# Altium schematic sheet 1_STM32F103C8-core.schdoc
size 497 x 243 mm; Name: A_A4; Symbol: A_A4; Device: A_A4; @Project Name: volume-adjuster-v1.0; REV: 1.0; Date: 2023-04-22; Sheet: 1/1; Draw By: wfei &amp; zzc; Company: 眼镜蛇小队; Convert to PCB: yes; Add into BOM: yes
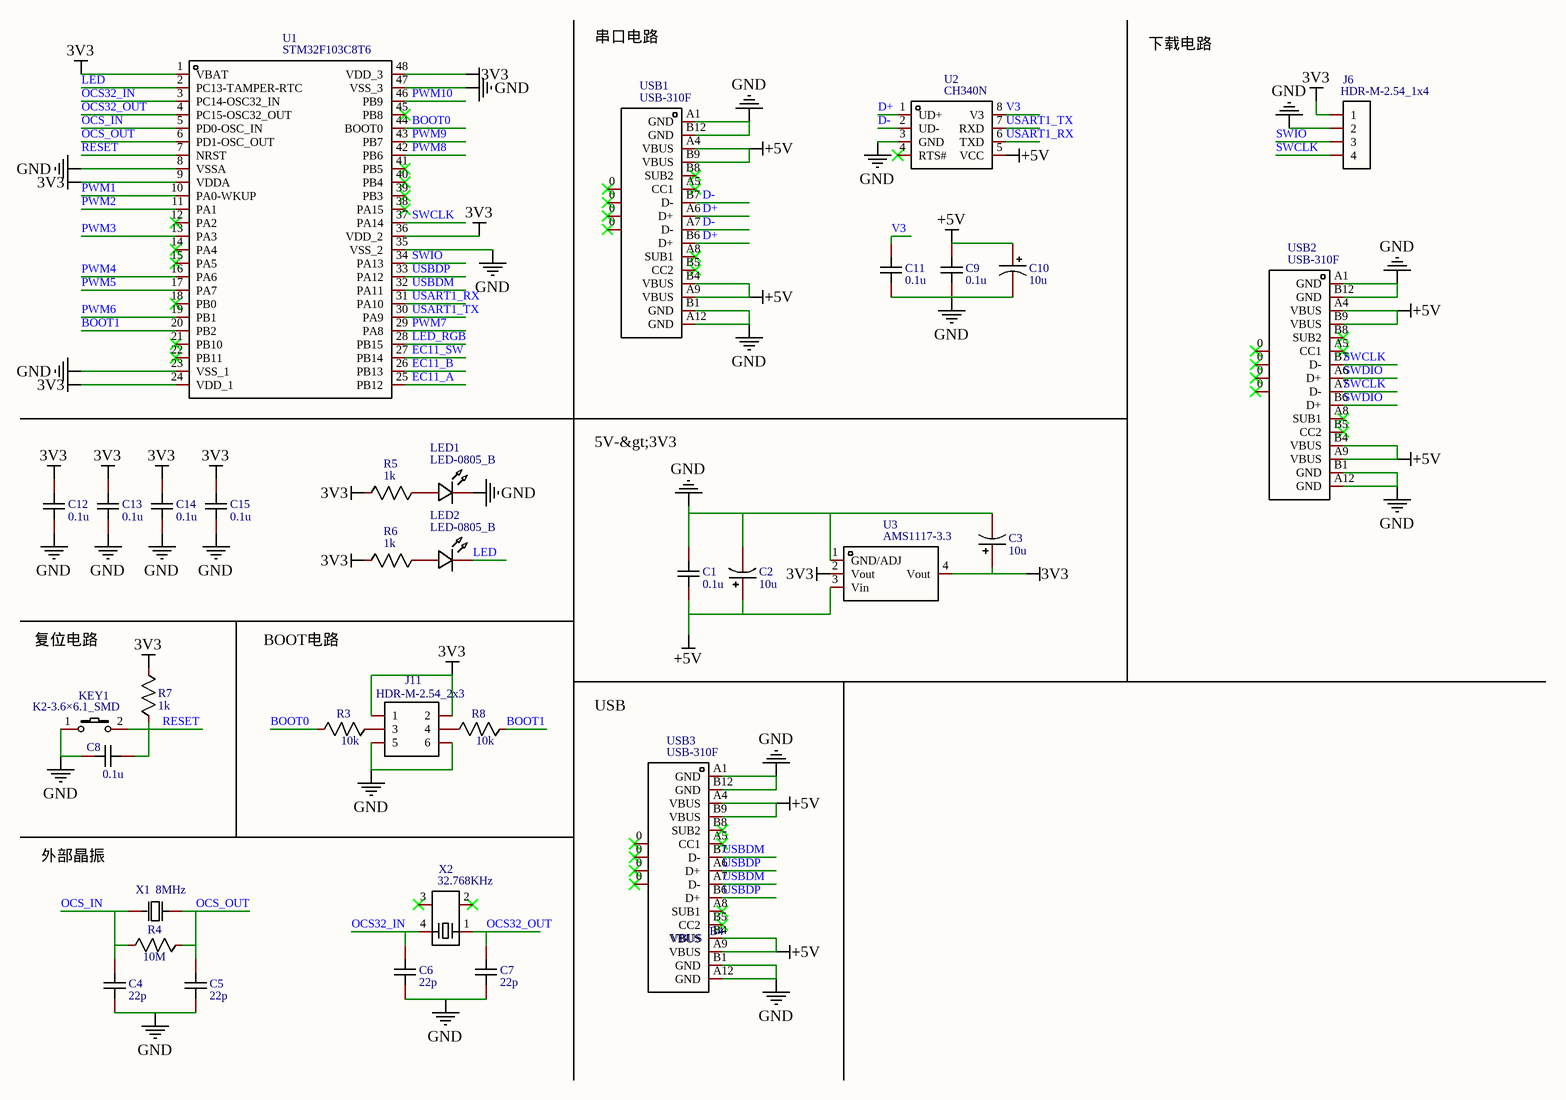
[diagram p0: 1_STM32F103C8-core.schdoc]

## Parts
C1  0.1u  [C0805]
C2  10u  [CASE-A_3216]
C3  10u  [CASE-A_3216]
C4  22p  [C0805]
C5  22p  [C0805]
C6  22p  [C0805]
C7  22p  [C0805]
C8  0.1u  [C0805]
C9  0.1u  [C0805]
C10  10u  [CASE-A_3216]
C11  0.1u  [C0805]
C12  0.1u  [C0805]
C13  0.1u  [C0805]
C14  0.1u  [C0805]
C15  0.1u  [C0805]
J6  HDR-M-2.54_1x4  [HDR-M-2.54_1X4]
J11  HDR-M-2.54_2x3  [HDR-M-2.54_2X3]
KEY1  K2-3.6×6.1_SMD  [KEY-SMD_2P-L6.2-W3.6-LS8.0]
LED1  LED-0805_B  [LED0805_BLUE]
LED2  LED-0805_B  [LED0805_BLUE]
R3  10k  [R0805]
R4  10M  [R0805]
R5  1k  [R0805]
R6  1k  [R0805]
R7  1k  [R0805]
R8  10k  [R0805]
U1  STM32F103C8T6  [LQFP-48_L7.0-W7.0-P0.50-LS9.0-BL]
U2  CH340N  [LM393_SOP8]
U3  AMS1117-3.3  [SOT-223-3_L6.5-W3.4-P2.30-LS7.0-BR]
USB1  USB-310F  [USB-C-SMD_20P-P0.50-L6.5-W8.9]
USB2  USB-310F  [USB-C-SMD_20P-P0.50-L6.5-W8.9]
USB3  NUMBER: B4  NAME: VBUS  [USB-C-SMD_20P-P0.50-L6.5-W8.9]  (hidden comment: USB-310F)
X1  8MHz  [OSC-TH_L11.1-W4.7-P4.88]
X2  32.768KHz  [MC-306_4P-L8.0-W3.2-P5.5-BL]

## Nets
3V3: C3.1 C12.2 C13.2 C14.2 C15.2 J6.1 J11.1 J11.2 R5.1 R6.1 R7.2 U1.1(VBAT) U1.9(VDDA) U1.24(VDD_1) U1.36(VDD_2) U1.48(VDD_3) U3.2(Vout) U3.4(Vout)
+5V: C1.1 C2.1 C9.2 C10.1 U2.5(VCC) U3.3(Vin) USB1.A4(VBUS) USB1.A9(VBUS) USB1.B4(VBUS) USB1.B9(VBUS) USB2.A4(VBUS) USB2.A9(VBUS) USB2.B4(VBUS) USB2.B9(VBUS) USB3.A4(VBUS) USB3.A9(VBUS) USB3.B4(VBUS) USB3.B9(VBUS)
GND: C1.2 C2.2 C3.2 C4.1 C5.1 C6.1 C7.1 C8.2 C9.1 C10.2 C11.1 C12.1 C13.1 C14.1 C15.1 J6.2 J11.5 J11.6 KEY1.1 LED1.2 U1.8(VSSA) U1.23(VSS_1) U1.35(VSS_2) U1.47(VSS_3) U2.3(GND) U3.1(GND/ADJ) USB1.A1(GND) USB1.A12(GND) USB1.B1(GND) USB1.B12(GND) USB2.A1(GND) USB2.A12(GND) USB2.B1(GND) USB2.B12(GND) USB3.A1(GND) USB3.A12(GND) USB3.B1(GND) USB3.B12(GND)
BOOT0: R3.1 U1.44(BOOT0)
BOOT1: R8.2 U1.20(PB2)
D+: U2.1(UD+) USB1.A6(D+) USB1.B6(D+)
D-: U2.2(UD-) USB1.A7(D-) USB1.B7(D-)
EC11_A: U1.25(PB12)
EC11_B: U1.26(PB13)
EC11_SW: U1.27(PB14)
LED: LED2.2 U1.2(PC13-TAMPER-RTC)
LED_RGB: U1.28(PB15)
OCS32_IN: C6.2 U1.3(PC14-OSC32_IN) X2.4
OCS32_OUT: C7.2 U1.4(PC15-OSC32_OUT) X2.1
OCS_IN: C4.2 R4.1 U1.5(PD0-OSC_IN) X1.1(OSC1)
OCS_OUT: C5.2 R4.2 U1.6(PD1-OSC_OUT) X1.2(OSC2)
PWM1: U1.10(PA0-WKUP)
PWM2: U1.11(PA1)
PWM3: U1.13(PA3)
PWM4: U1.16(PA6)
PWM5: U1.17(PA7)
PWM6: U1.19(PB1)
PWM7: U1.29(PA8)
PWM8: U1.42(PB6)
PWM9: U1.43(PB7)
PWM10: U1.46(PB9)
RESET: C8.1 KEY1.2 R7.1 U1.7(NRST)
SWCLK: J6.4 U1.37(PA14) USB2.A7(D-) USB2.B7(D-)
SWDIO: USB2.A6(D+) USB2.B6(D+)
SWIO: J6.3 U1.34(PA13)
USART1_RX: U1.31(PA10) U2.6(TXD)
USART1_TX: U1.30(PA9) U2.7(RXD)
USBDM: U1.32(PA11) USB3.A7(D-) USB3.B7(D-)
USBDP: U1.33(PA12) USB3.A6(D+) USB3.B6(D+)
V3: C11.2 U2.8(V3)
NetJ11_3: J11.3 R3.2
NetJ11_4: J11.4 R8.1
NetLED1_1: LED1.1 R5.2
NetLED2_1: LED2.1 R6.2

Not connected (* = marked no-connect by the designer): U1 12(PA2)* 14(PA4)* 15(PA5)* 18(PB0)* 21(PB10)* 22(PB11)* 38(PA15)* 39(PB3)* 40(PB4)* 41(PB5)* 45(PB8)*; U2 4(RTS#)*; USB1 0* A5(CC1)* A8(SUB1)* B5(CC2)* B8(SUB2)*; USB2 0* A5(CC1)* A8(SUB1)* B5(CC2)* B8(SUB2)*; USB3 0* A5(CC1)* A8(SUB1)* B5(CC2)* B8(SUB2)*; X2 2* 3*

## Notes on the sheet
- 串口电路
- 下载电路
- 5V-&gt;3V3
- 复位电路
- BOOT电路
- USB
- 外部晶振
- 1
- 2
- 3
- 4
- 5
- A
- B
- C
- D
- TITLE:
- volume-adjuster-v1.0
- REV:
- 1.0
- Date:
- Company:
- 2023-04-22
- 眼镜蛇小队
- Drawn By:
- wfei &amp; zzc
- Sheet:
- 1/1

## Library data of the parts
C1 C8 C9 C11-C15 = 0.1u: Convert to PCB: yes; Name: 0.1u; Symbol: 0.1u; Device: 0.1u; Add into BOM: yes; Origin Footprint: C0805
C2 C3 C10 = 10u: Convert to PCB: yes; Name: 10u; Symbol: 10u; Device: 10u; Add into BOM: yes; Origin Footprint: CASE-A_3216
C4-C7 = 22p: Convert to PCB: yes; Name: 22p; Symbol: 22p; Device: 22p; Add into BOM: yes; Origin Footprint: C0805
J6 = HDR-M-2.54_1x4: Convert to PCB: yes; Name: HDR-M-2.54_1x4; Symbol: HDR-M-2.54_1x4; Device: HDR-M-2.54_1x4; Supplier Part: C124378; Supplier: LCSC; Add into BOM: yes; Origin Footprint: HDR-M-2.54_1X4
J11 = HDR-M-2.54_2x3: Convert to PCB: yes; Name: HDR-M-2.54_2x3; Symbol: HDR-M-2.54_2x3; Device: HDR-M-2.54_2x3; Supplier Part: C65114; Supplier: LCSC; Add into BOM: yes; Origin Footprint: HDR-M-2.54_2X3
KEY1 = K2-1107ST-A4SW-06: 制造商: 韩国韩荣; Convert to PCB: yes; Name: K2-3.6×6.1_SMD; Symbol: K2-3.6×6.1_SMD; Device: K2-1107ST-A4SW-06; Supplier Part: C118141; Supplier: LCSC; Manufacturer Part: K2-1107ST-A4SW-06; Add into BOM: yes; Origin Footprint: KEY-SMD_2P-L6.2-W3.6-LS8.0
LED1 LED2 = D-B080508B1-KS2: Manufacturer: 方舟 ARKLED; Convert to PCB: yes; Name: LED-0805_B; Symbol: LED-0805_B; Device: D-B080508B1-KS2; Manufacturer Part: D-B080508B1-KS2; Supplier Part: C108412; Add into BOM: yes; Origin Footprint: LED0805_BLUE
R3 R8 = 10k: Convert to PCB: yes; Name: 10k; Symbol: 10k; Device: 10k; Add into BOM: yes; Origin Footprint: R0805
R4 = 10M: Convert to PCB: yes; Name: 10M; Symbol: 10M; Device: 10M; Add into BOM: yes; Origin Footprint: R0805
R5-R7 = 1k: Convert to PCB: yes; Name: 1k; Symbol: 1k; Device: 1k; Add into BOM: yes; Origin Footprint: R0805
U1 = STM32F103C8T6: Manufacturer: STMicroelectronics; Convert to PCB: yes; Name: STM32F103C8T6; Symbol: STM32F103C8T6; Device: STM32F103C8T6; Supplier: LCSC; Manufacturer Part: STM32F103C8T6; image: //image.lceda.cn/szlcsc/C8734.jpg; Supplier Part: C8734; JLCPCB Part Class: Basic; Add into BOM: yes; Origin Footprint: LQFP-48_L7.0-W7.0-P0.50-LS9.0-BL
U2 = CH340N: Add into BOM: yes; Name: CH340N; Symbol: CH340N; Device: CH340N; Convert to PCB: yes; Origin Footprint: LM393_SOP8
U3 = AMS1117-3.3: Manufacturer: AMS; Convert to PCB: yes; Name: AMS1117-3.3; Symbol: AMS1117-3.3; Device: AMS1117-3.3; Supplier: LCSC; Manufacturer Part: AMS1117-3.3; image: //image.lceda.cn/szlcsc/C6186.jpg; Supplier Part: C6186; JLCPCB Part Class: Basic; Add into BOM: yes; Origin Footprint: SOT-223-3_L6.5-W3.4-P2.30-LS7.0-BR
USB1-USB3 = USB-310F: Manufacturer: HOOYA; Convert to PCB: yes; Name: USB-310F; Symbol: USB-310F; Device: USB-310F; Supplier: LCSC; Supplier Part: C309365; Manufacturer Part: USB-310F; Add into BOM: yes; Origin Footprint: USB-C-SMD_20P-P0.50-L6.5-W8.9
X1 = S1C80000VWGAC: 频率:8MHz;频率公差:±20ppm;频率稳定度:±30ppm;负载电容:16pF;; Manufacturer: JYJE(晶友嘉); Add into BOM: yes; Crystal Type: 直插无源晶振; Frequency Tolerance: ±20ppm; Frequency Stability: ±30ppm; Load Capacitance: 16pF; Equivalent Series Resistance (ESR): 60Ω; NAME: OSC2; NUMBER: 2; Pin Type: IN; Name: 8MHz; Symbol: S1C80000VWGAC; Device: S1C80000VWGAC; LCSC Part Name: 8MHz ±20ppm 内置负载电容:16pF; Supplier Part: C2826849; Manufacturer Part: S1C80000VWGAC; Supplier Footprint: HC-49S; JLCPCB Part Class: Extended Part; Datasheet: https://atta.szlcsc.com/upload/public/pdf/source/20210114/C2149361_EC5FF9631B356CE93CF7A73B2F67D17A.pdf; Supplier: LCSC; Convert to PCB: yes; Value: 8MHz; Operating Temperature: -40℃~+85℃
X2 = Q13MC3061000300: Manufacturer: EPSON; Convert to PCB: yes; Name: 32.768KHz; Symbol: 32.768KHz; Device: Q13MC3061000300; Supplier: LCSC; Manufacturer Part: Q13MC3061000300; Supplier Part: C16320; JLCPCB Part Class: Extend; Add into BOM: yes; Origin Footprint: MC-306_4P-L8.0-W3.2-P5.5-BL